# EAGLE design Exposure Timer (EAGLE 6.4)
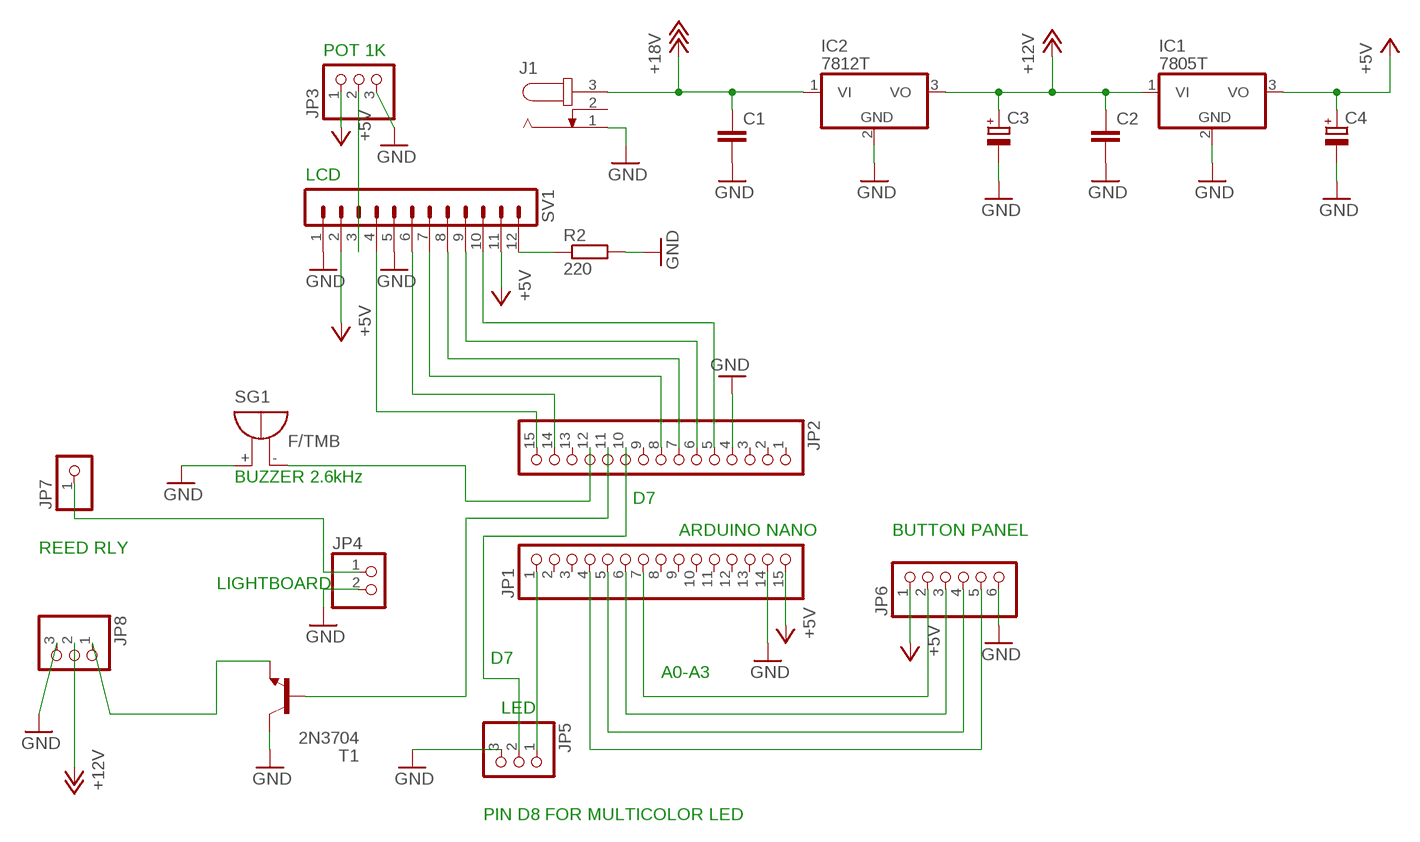
[diagram p0: schematic, sheet 1]

## Parts
C1  C-EU025-030X050  [C025-030X050]
C2  C-EU025-030X050  [C025-030X050]
C3  CPOL-EUE2,5-6E  [E2,5-6E]
C4  CPOL-EUE2,5-6E  [E2,5-6E]
IC1  7805T  [TO220H]
IC2  7812T  [TO220H]
J1  JACK-PLUG1  [SPC4078]
JP1  PINHD-1X15  [1X15]
JP2  PINHD-1X15  [1X15]
JP3  PINHD-1X3  [1X03]
JP4  PINHD-1X2  [1X02]
JP5  PINHD-1X3  [1X03]
JP6  PINHD-1X6  [1X06]
JP7  PINHD-1X1  [1X01]
JP8  PINHD-1X3  [1X03]
R2  220  R-EU_0204/7  [0204/7]
SG1  F/TMB  [F/TMB]
SV1  MA12-1  [MA12-1]
T1  2N3704  [TO92]

## Nets
+5V: C4.+ IC1.3(VO) JP1.15 JP3.1 JP6.1 SV1.2 SV1.11
+12V: C2.1 C3.+ IC1.1(VI) IC2.3(VO) JP8.2
+18V: C1.1 IC2.1(VI) J1.3
GND: C1.2 C2.2 C3.- C4.- IC1.2(GND) IC2.2(GND) J1.1 JP1.14 JP2.4 JP3.3 JP4.2 JP5.3 JP6.6 JP8.3 R2.2 SG1.+ SV1.1 SV1.5 T1.2(C)
N$1: R2.1 SV1.12
N$2: JP2.8 SV1.7
N$3: JP2.6 SV1.9
N$4: JP1.1 JP5.1
N$5: JP2.5 SV1.10
N$7: JP2.14 SV1.6
N$8: JP2.15 SV1.4
N$9: JP2.12 SG1.-
N$10: JP3.2 SV1.3
N$11: JP2.10 JP5.2
N$12: JP2.7 SV1.8
N$13: JP8.1 T1.3(E)
N$14: JP4.1 JP7.1
N$17: JP1.7 JP6.2
N$18: JP1.6 JP6.3
N$19: JP1.5 JP6.4
N$20: JP1.4 JP6.5
T1: JP2.11 T1.1(B)
Unconnected: J1.2 JP1.2 JP1.3 JP1.8 JP1.9 JP1.10 JP1.11 JP1.12 JP1.13 JP2.1 JP2.2 JP2.3 JP2.9 JP2.13

## Notes on the sheet
- POT 1K
- LCD
- BUZZER 2.6kHz
- D7
- ARDUINO NANO | BUTTON PANEL
- REED RLY
- LIGHTBOARD
- D7
- A0-A3
- LED
- PIN D8 FOR MULTICOLOR LED

## Library data of the parts
C1 C2 = rcl:C-EU: CAPACITOR, European symbol
C3 C4 = rcl:CPOL-EU: POLARIZED CAPACITOR, European symbol
IC1 IC2 = linear:78*: Positive VOLTAGE REGULATOR Source: http://cache.national.com/ds/LM/LM78L05.pdf http://www.fairchildsemi.com/ds/LM/LM7805.pdf
J1 = con-jack:JACK-PLUG: DC POWER JACK Power Jack, DC, Right Angle, Through Hole, Rated 5A at 16VDC, PC Terminals Distributor: Farnell (www.Farnell.de) Drawing: 84N1161.pdf / 84N1162.pdf Manufacturer: SPC Technology (www.spctechnology.com) Type: SPC4077 / SPC 4078; OC_FARNELL: unknown; OC_NEWARK: unknown
JP1 JP2 = pinhead:PINHD-1X15: PIN HEADER
JP3 JP5 JP8 = adafruit:PINHD-1X3: PIN HEADER
JP4 = pinhead:PINHD-1X2: PIN HEADER
JP6 = adafruit:PINHD-1X6: PIN HEADER
JP7 = adafruit:PINHD-1X1: Pin header 1x1 for 0.1" spacing With round pins
R2 = resistor:R-EU_: RESISTOR, European symbol
SG1 = buzzer:F/TMB: BUZZER Source: Buerklin; OC_FARNELL: unknown; OC_NEWARK: unknown
SV1 = con-lstb:MA12-1: PIN HEADER; OC_FARNELL: unknown; OC_NEWARK: unknown
T1 = transistor:2N3704: NPN TRANSISTOR

## Net classes
0 default: width 0.762 mm, drill 0.559 mm, clearance 0.762 mm

## Board
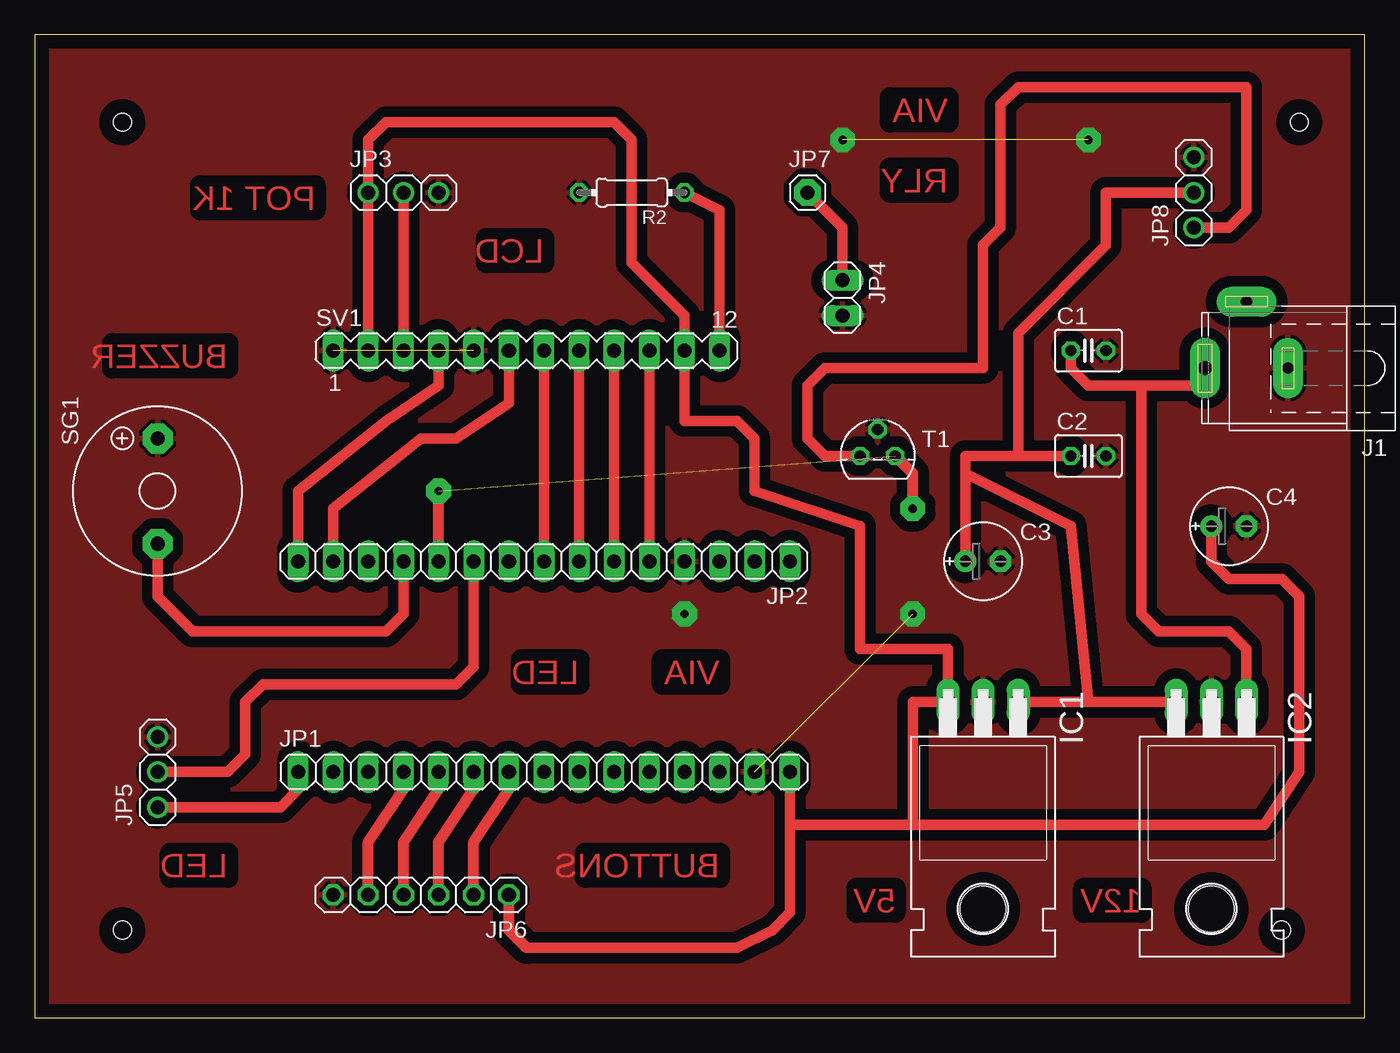
[diagram p1: board, top side]

Size 96.19 x 71.11 mm. Coordinates in mm from the lower left corner, seen from the top.
Outline: 0,0 96.19,0 96.19,71.11 0,71.11 0,0
Copper layers (1*16): Top 0.035mm / dielectric 1.5mm / Bottom 0.035mm
Design rules "default": minimum track width 10mil, minimum drill 24mil, track to track 8mil, track to pad 8mil, pad to pad 8mil, via to via 8mil, smd to smd 8mil, copper to edge 40mil, drill to drill 8mil, minimum pad ring 10mil, minimum via ring 8mil, stop-mask expansion 4mil, vias tented up to drill 0mil, thermal gap 10mil
Holes 1.3 mm at 6.35,6.35 6.35,64.77 91.44,64.77 90.17,6.35

### Footprints (pad centres in the part's own frame; a part is rotated, then mirrored left to right if it is on the bottom)
C025-030X050 = drill 0.813 octagon: 1 -1.27,0; 2 1.27,0
E2,5-6E = drill 0.813 pad 1.575: + -1.27,0 | drill 0.813 pad 1.575 octagon: - 1.27,0
TO220H = drill 1.118 long: 1 -2.54,-10.16; 2 0,-10.16; 3 2.54,-10.16 | hole 3.302: 0,4.826
SPC4078 = drill 0.8 pad 2.184 long: 1 -3,0; 2 0,-4.8 | drill 1 pad 2.184 long: 3 3,0
1X15 = drill 1.016 long: 1 -17.78,0; 2 -15.24,0; 3 -12.7,0; 4 -10.16,0; 5 -7.62,0; 6 -5.08,0; 7 -2.54,0; 8 0,0; 9 2.54,0; 10 5.08,0; 11 7.62,0; 12 10.16,0; 13 12.7,0; 14 15.24,0; 15 17.78,0
1X03 = drill 1.016: 1 -2.54,0; 2 0,0; 3 2.54,0
1X02 = drill 1.016 long: 1 -1.27,0; 2 1.27,0
1X06 = drill 1.016 octagon: 1 -6.35,0; 2 -3.81,0; 3 -1.27,0; 4 1.27,0; 5 3.81,0; 6 6.35,0
1X01 = drill 1.016 pad 1.93 octagon: 1 0,0
0204/7 = drill 0.813 octagon: 1 -3.81,0; 2 3.81,0
F/TMB = drill 1.016 pad 2.159 octagon: + 3.81,0; - -3.81,0
MA12-1 = drill 1.016 long: 1 -13.97,0; 2 -11.43,0; 3 -8.89,0; 4 -6.35,0; 5 -3.81,0; 6 -1.27,0; 7 1.27,0; 8 3.81,0; 9 6.35,0; 10 8.89,0; 11 11.43,0; 12 13.97,0
TO92 = drill 0.813 octagon: 1 1.27,0; 2 0,1.905; 3 -1.27,0

### Placement (x,y rotation side)
C1  76.2,48.26 0 top
C2  76.2,40.64 0 top
C3  68.58,33.02 0 top
C4  86.36,35.56 0 top
IC1  68.58,12.7 180 top
IC2  85.09,12.7 180 top
J1  87.63,46.99 180 top
JP1  36.83,17.78 0 top
JP2  36.83,33.02 180 top
JP3  26.67,59.69 0 top
JP4  58.42,52.07 270 top
JP5  8.89,17.78 90 top
JP6  27.94,8.89 180 top
JP7  55.88,59.69 0 top
JP8  83.82,59.69 90 top
R2  43.18,59.69 180 top
SG1  8.89,38.1 90 top
SV1  35.56,48.26 0 top
T1  60.96,40.64 0 top

### Tracks (layer width: path | path; a pad name or v marks a point on that pad's centre or on a via)
+5V
  Top 0.762: SV1.2 JP3.1 24.13,63.5 25.4,64.77 41.91,64.77 43.18,63.5 43.18,54.61 46.99,50.8 SV1.11 46.99,43.18 50.8,43.18 52.07,41.91 52.07,38.1 59.69,35.56 59.69,26.67 66.04,26.67 IC1.3 63.5,22.86 63.5,13.97 | 35.56,5.08 50.8,5.08 53.34,6.35 54.61,7.62 54.61,13.97 | JP1.15 54.61,13.97 | C4.+ 85.09,33.02 86.36,31.75 90.17,31.75 91.44,30.48 91.44,17.78 88.9,13.97 63.5,13.97 | 54.61,13.97 63.5,13.97
  Top 0.813: 35.56,5.08 34.29,6.35 JP6.1
+12V
  Top 0.762: IC2.3 76.2,22.86 | 76.2,22.86 IC1.1 | 71.12,40.64 67.31,40.64 67.31,39.37 | 71.12,40.64 C2.1 | C3.+ 67.31,39.37 | JP8.2 77.47,59.69 77.47,55.88 71.12,49.53 71.12,40.64 | 76.2,22.86 74.93,35.56 67.31,39.37
+18V
  Top 0.762: C1.1 74.93,46.99 76.2,45.72 80.01,45.72 | 80.01,45.72 85.09,45.72 85.09,46.99 J1.3 | IC2.1 87.63,26.67 86.36,27.94 81.28,27.94 80.01,29.21 80.01,45.72
GND  (via drill 0.6 pad 1.78)  (3 unrouted)
  other vias: 76.2,63.5 58.42,63.5 63.5,29.21 46.99,29.21
  pour Top: -2.54,73.66 99.06,73.66 99.06,-2.54 -2.54,-2.54
N$1
  Top 0.762: R2.1 49.53,58.42 SV1.12
N$2
  Top 0.762: SV1.7 JP2.8
N$3
  Top 0.762: SV1.9 JP2.6
N$4
  Top 0.762: JP5.1 17.78,15.24 19.05,16.51 JP1.1
N$5
  Top 0.762: SV1.10 JP2.5
N$7
  Top 0.762: JP2.14 21.59,36.83 27.94,41.91 30.48,41.91 34.29,44.45 SV1.6
N$8
  Top 0.762: JP2.15 19.05,38.1 25.4,43.18 29.21,45.72 SV1.4
N$9
  Top 0.762: JP2.12 26.67,29.21 25.4,27.94 11.43,27.94 8.89,30.48 SG1.-
N$10
  Top 0.762: JP3.2 SV1.3
N$11
  Top 0.762: JP5.2 13.97,17.78 15.24,19.05 15.24,22.86 16.51,24.13 30.48,24.13 31.75,25.4 JP2.10
N$12
  Top 0.762: SV1.8 JP2.7
N$13
  Top 0.762: T1.3 57.15,40.64 55.88,41.91 55.88,45.72 57.15,46.99 68.58,46.99 68.58,55.88 69.85,57.15 69.85,66.04 71.12,67.31 87.63,67.31 87.63,58.42 86.36,57.15 JP8.1
N$14
  Top 0.762: JP7.1 58.42,57.15 JP4.1
N$17
  Top 0.813: JP6.2 31.75,12.7 34.29,16.51 JP1.7
N$18
  Top 0.813: JP6.3 29.21,12.7 31.75,16.51 JP1.6
N$19
  Top 0.813: JP6.4 26.67,12.7 29.21,16.51 JP1.5
N$20
  Top 0.813: JP6.5 24.13,12.7 26.67,16.51 JP1.4
T1  (via drill 0.6 pad 1.78)  (1 unrouted)
  Top 0.813: JP2.11 v29.21,38.1 | v63.5,36.83 63.5,39.37 T1.1

### Text on the board
Top: VIA | RLY | POT 1K | LCD | BUZZER | LED | VIA | LED | BUTTONS | 5V | 12V